# EAGLE design Pi (EAGLE 7.2.0)
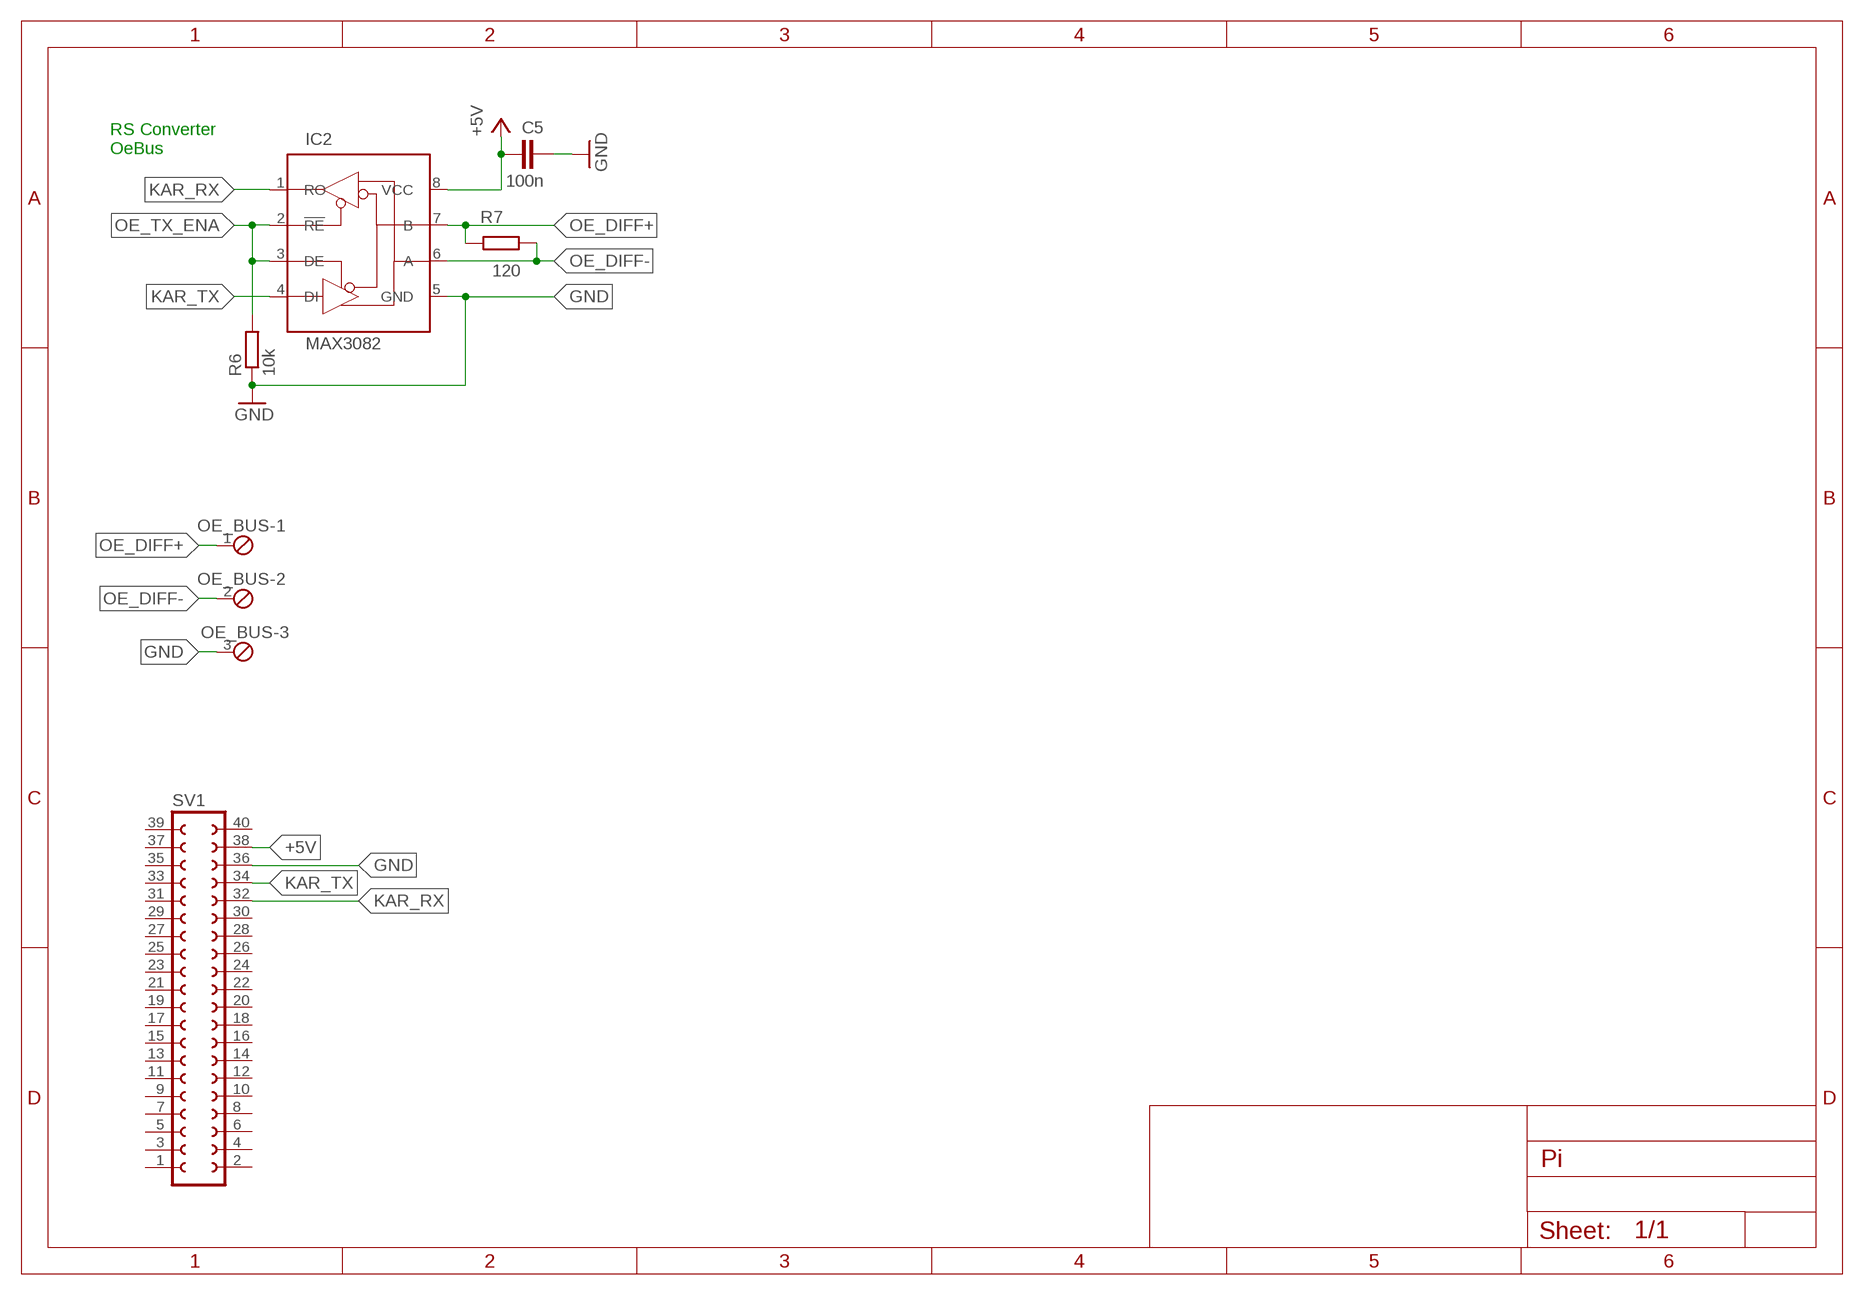
[diagram p0: schematic, sheet 1]

## Parts
C5  100n  C5/3  [C5B3]
IC2  MAX3082  MAX3082CPD  [DIL08]
OE_BUS  MPT3  [3POL254]
R6  10k  R-EU_0207/12  [0207/12]
R7  120  R-EU_0207/12  [0207/12]
SV1  FE20-2  [FE20-2]

## Nets
+5V: SV1.38
GND: C5.2 IC2.5(GND) OE_BUS.3 R6.1 SV1.36
KAR_RX: IC2.1(RO) SV1.32
KAR_TX: IC2.4(DI) SV1.34
OE_DIFF+: IC2.7(B) OE_BUS.1 R7.2
OE_DIFF-: IC2.6(A) OE_BUS.2 R7.1
OE_TX_ENA: IC2.2(!RE!) IC2.3(DE) R6.2
VCC: C5.1 IC2.8(VCC) ; supply symbol labelled +5V
Unconnected: SV1.1 SV1.2 SV1.3 SV1.4 SV1.5 SV1.6 SV1.7 SV1.8 SV1.9 SV1.10 SV1.11 SV1.12 SV1.13 SV1.14 SV1.15 SV1.16 SV1.17 SV1.18 SV1.19 SV1.20 SV1.21 SV1.22 SV1.23 SV1.24 SV1.25 SV1.26 SV1.27 SV1.28 SV1.29 SV1.30 SV1.31 SV1.33 SV1.35 SV1.37 SV1.39 SV1.40

## Notes on the sheet
- RS Converter
  OeBus

## Library data of the parts
C5 = capacitor-wima:C: CAPACITOR naming: grid - package width
IC2 = myLibrary:MAX3082: RS485 transceiver Converting from logical RS232 to differential RS485, and vice versa.; OC_FARNELL: unknown; OC_NEWARK: unknown
OE_BUS = con-phoenix-254:MPT3: PHOENIX CONNECTOR; OC_FARNELL: unknown; OC_NEWARK: unknown
R6 R7 = resistor:R-EU_: RESISTOR, European symbol
SV1 = con-lsta:FE20-2: FEMALE HEADER; OC_FARNELL: unknown; OC_NEWARK: unknown

## Board
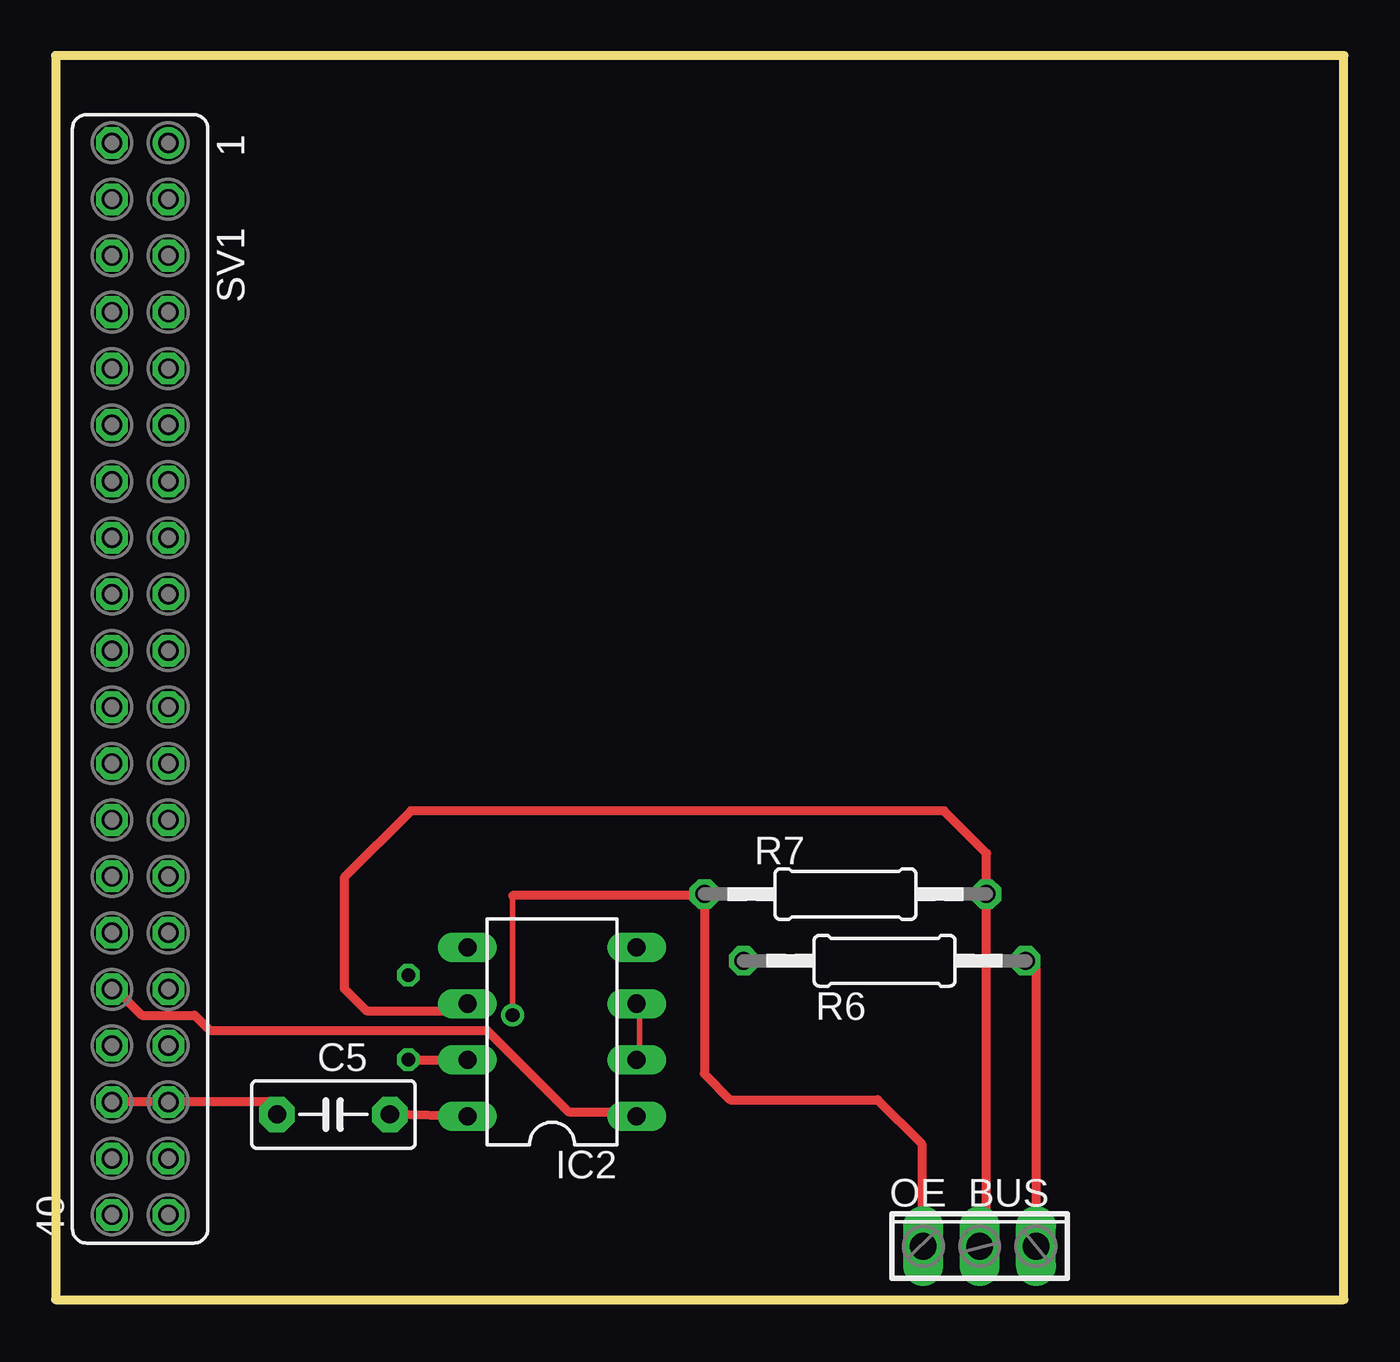
[diagram p1: board, top side]
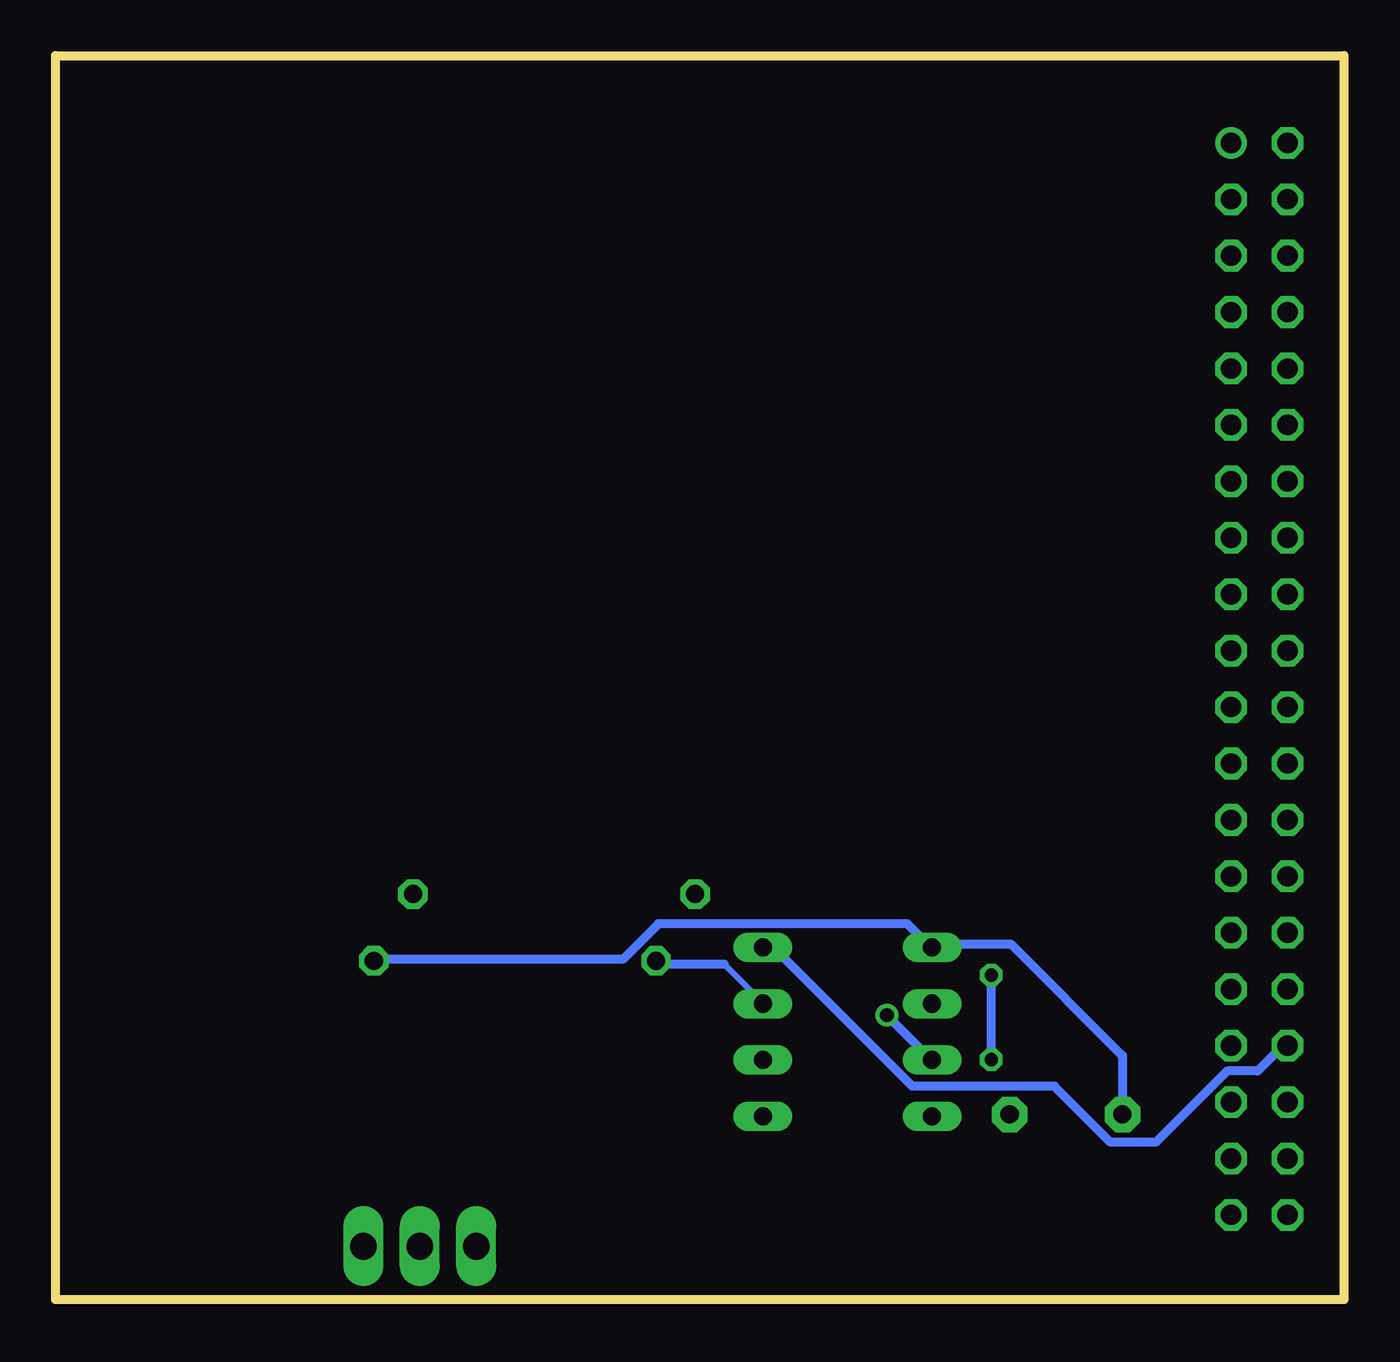
[diagram p2: board, bottom side, seen from below]

Size 58 x 56 mm. Coordinates in mm from the lower left corner, seen from the top.
Outline: 0,0 58,0 58,56 0,56 0,0
Copper layers (1*16): Top 0.035mm / dielectric 1.5mm / Bottom 0.035mm
Design rules "default": minimum track width 10mil, minimum drill 24mil, track to track 8mil, track to pad 8mil, pad to pad 8mil, via to via 8mil, smd to smd 8mil, copper to edge 40mil, drill to drill 8mil, minimum pad ring 10mil, minimum via ring 8mil, stop-mask expansion 4mil, vias tented up to drill 0mil, thermal gap 10mil

### Footprints (pad centres in the part's own frame; a part is rotated, then mirrored left to right if it is on the bottom)
C5B3 = drill 0.813 pad 1.6 octagon: 1 -2.54,0; 2 2.54,0
DIL08 = drill 0.813 long: 1 -3.81,-3.81; 2 -1.27,-3.81; 3 1.27,-3.81; 4 3.81,-3.81; 5 3.81,3.81; 6 1.27,3.81; 7 -1.27,3.81; 8 -3.81,3.81
3POL254 = drill 1.2 long: 1 -2.54,0; 2 0,0; 3 2.54,0
0207/12 = drill 0.813 octagon: 1 -6.35,0; 2 6.35,0
FE20-2 = drill 0.914: 1 -24.13,1.27 | drill 0.914 octagon: 2 -24.13,-1.27; 3 -21.59,1.27; 4 -21.59,-1.27; 5 -19.05,1.27; 6 -19.05,-1.27; 7 -16.51,1.27; 8 -16.51,-1.27; 9 -13.97,1.27; 10 -13.97,-1.27; 11 -11.43,1.27; 12 -11.43,-1.27; 13 -8.89,1.27; 14 -8.89,-1.27; 15 -6.35,1.27; 16 -6.35,-1.27; 17 -3.81,1.27; 18 -3.81,-1.27; 19 -1.27,1.27; 20 -1.27,-1.27; 21 1.27,1.27; 22 1.27,-1.27; 23 3.81,1.27; 24 3.81,-1.27; 25 6.35,1.27; 26 6.35,-1.27; 27 8.89,1.27; 28 8.89,-1.27; 29 11.43,1.27; 30 11.43,-1.27; 31 13.97,1.27; 32 13.97,-1.27; 33 16.51,1.27; 34 16.51,-1.27; 35 19.05,1.27; 36 19.05,-1.27; 37 21.59,1.27; 38 21.59,-1.27; 39 24.13,1.27; 40 24.13,-1.27

### Placement (x,y rotation side)
C5  12.51,8.33 180 top
IC2  22.35,12.05 90 top
OE_BUS  41.6,2.4 0 top
R6  37.32,15.25 180 top
R7  35.56,18.25 180 top
SV1  3.81,27.94 270 top

### Tracks (layer width: path | path; a pad name or v marks a point on that pad's centre or on a via)
GND
  Top 0.406: R6.1 44.14,15.25 OE_BUS.3 | C5.2 9.97,8.89 SV1.36
  Bottom 0.254: 43.66,15.32 R6.1 | 18.75,16 IC2.5
  Bottom 0.406: IC2.5 18.4,16 15,16 9.97,10.97 C5.2 | 43.66,15.32 32.46,15.32 30.86,16.92 19.66,16.92 18.75,16
KAR_RX
  Top 0.254: 26.06,8.46 IC2.1 | 2.74,13.95 SV1.32
  Top 0.406: 26.06,8.46 23.09,8.46 19.43,12.12 6.94,12.12 6.26,12.8 3.89,12.8 2.74,13.95
KAR_TX
  Bottom 0.254: 25.6,15.77 26.06,15.77 IC2.4 | 2.74,11.43 SV1.34
  Bottom 0.406: 25.6,15.77 19.43,9.6 13.03,9.6 10.52,7.09 8.46,7.09 5.26,10.29 3.89,10.29 2.74,11.43
N$1  (via drill 0.6)
  Bottom 0.406: v15.88,14.61 arc-90 15.89,14.59 15.89,10.86
N$3  (via drill 0.6)
  Top 0.406: v15.88,10.79 18.52,10.79
OE_DIFF+  (via drill 0.61)
  Top 0.254: 20.57,18.19 v20.57,12.8
  Top 0.406: OE_BUS.1 39,2.46 39,7 37,9 30.37,9 29.21,10.16 R7.2 29.21,18.19 20.57,18.19
  Bottom 0.254: 18.75,10.97 IC2.7
  Bottom 0.406: v20.57,12.8 18.75,10.97
OE_DIFF-
  Top 0.406: OE_BUS.2 41.91,2.4 R7.1 41.91,20.09 40,22 16,22 13,19 13,14 14,13 18.22,13 IC2.6
OE_TX_ENA
  Top 0.254: IC2.2 26.29,10.97 26.29,13.26 IC2.3
  Bottom 0.254: 27.89,15.09 26.29,13.49 IC2.3 | 30.86,15.09 R6.2
  Bottom 0.406: 27.89,15.09 30.86,15.09
VCC
  Top 0.406: IC2.8 C5.1